# Altium schematic sheet RainbowClock.SchDoc: Rainbow Clock Project
size A4; DrawnBy: vchesnea; Organization: In alphabetical order:; Address2: - schiad; Address3: - vchesnea; Revision: A
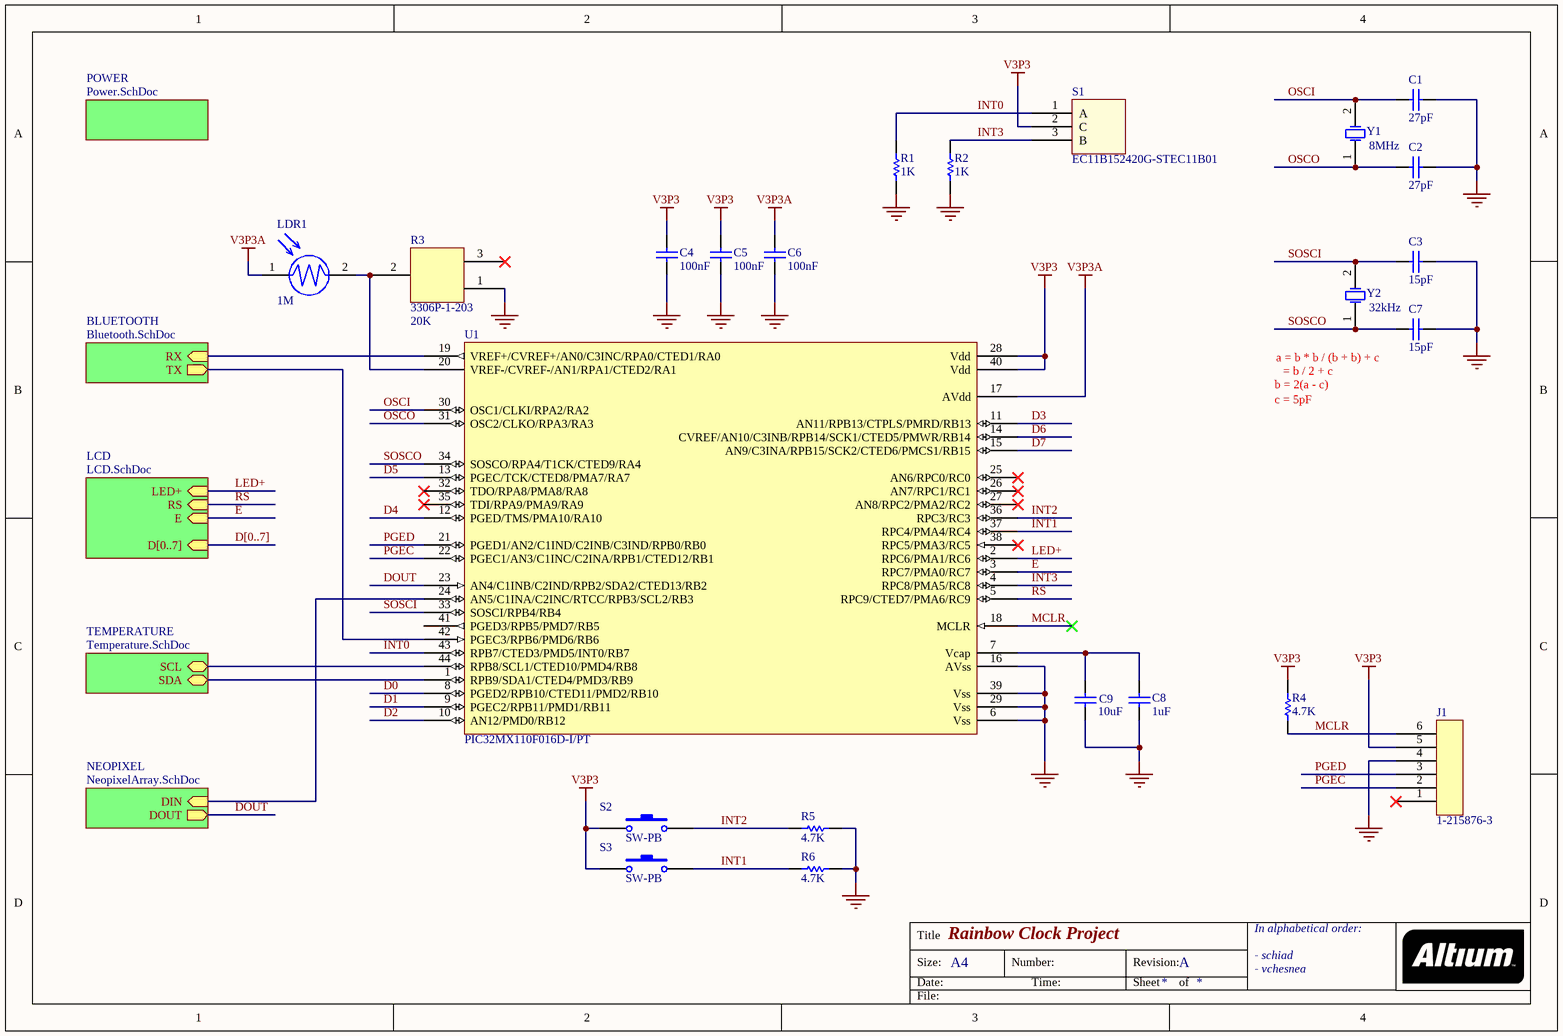
[diagram p0: RainbowClock.SchDoc]

## Parts
C1  27pF  [CAP0603]
C2  27pF  [CAP0603]
C3  15pF  [CAP0603]
C4  100nF  [CAP0603]
C5  100nF  [CAP0603]
C6  100nF  [CAP0603]
C7  15pF  [CAP0603]
C8  1uF  [CAP0603]
C9  10uF  [CAP0603]
J1  1-215876-3  [1-215876-3]
LDR1  value 1M  [VT935G]  (hidden comment: LDR)
R1  1K  [RES0603]
R2  1K  [RES0603]
R3  3306P-1-203  value 20K  [3306P-1-202]
R4  4.7K  [RES0603]
R5  4.7K  [RES0603]
R6  4.7K  [RES0603]
S1  EC11B152420G-STEC11B01  [EC11B152420G-STEC11B01]
S2  SW-PB  [1-1825027-4]
S3  SW-PB  [1-1825027-4]
U1  PIC32MX110F016D-I/PT  [PIC32MX110F016H-I/PT]
Y1  value 8MHz  [FOXSLF/080-20]  (hidden comment: 8MHz XTAL)
Y2  value 32kHz  [NCL38LF]  (hidden comment: 32kHz XTAL)

## Sub-sheets
BLUETOOTH = Bluetooth.SchDoc: RX (in), TX (out)
LCD = LCD.SchDoc: RS (in), E (in), LED+ (in), D[0..7] (in)
NEOPIXEL = NeopixelArray.SchDoc: DIN (in), DOUT (out)
POWER = Power.SchDoc: no entries
TEMPERATURE = Temperature.SchDoc: SDA (bidir), SCL (bidir)

## Nets
GND: C1.2 C2.2 C3.2 C4.1 C5.1 C6.1 C7.2 C8.1 C9.1 J1.4 R1.2 R2.1 R3.1 R5.1 R6.1 U1.6(Vss) U1.16(AVss) U1.29(Vss) U1.39(Vss)
V3P3: C4.2 C5.2 J1.5 R4.2 S1.2(C) S2.1 S3.2 U1.28(Vdd) U1.40(Vdd)
V3P3A: C6.2 LDR1.1 U1.17(AVdd)
D0: U1.8(PGED2/RPB10/CTED11/PMD2/RB10)
D1: U1.9(PGEC2/RPB11/PMD1/RB11)
D2: U1.10(AN12/PMD0/RB12)
D3: U1.11(AN11/RPB13/CTPLS/PMRD/RB13)
D4: U1.12(PGED/TMS/PMA10/RA10)
D5: U1.13(PGEC/TCK/CTED8/PMA7/RA7)
D6: U1.14(CVREF/AN10/C3INB/RPB14/SCK1/CTED5/PMWR/RB14)
D7: U1.15(AN9/C3INA/RPB15/SCK2/CTED6/PMCS1/RB15)
DOUT: U1.23(AN4/C1INB/C2IND/RPB2/SDA2/CTED13/RB2) ; sheet NEOPIXEL/DOUT
E: U1.3(RPC7/PMA0/RC7) ; sheet LCD/E
INT0: R1.1 S1.1(A) U1.43(RPB7/CTED3/PMD5/INT0/RB7)
INT1: R6.2 S3.1 U1.37(RPC4/PMA4/RC4)
INT2: R5.2 S2.2 U1.36(RPC3/RC3)
INT3: R2.2 S1.3(B) U1.4(RPC8/PMA5/RC8)
LED+: U1.2(RPC6/PMA1/RC6) ; sheet LCD/LED+
MCLR: J1.6 R4.1 U1.18(MCLR)
OSCI: C1.1 U1.30(OSC1/CLKI/RPA2/RA2) Y1.2(OSC2)
OSCO: C2.1 U1.31(OSC2/CLKO/RPA3/RA3) Y1.1(OSC1)
PGEC: J1.2 U1.22(PGEC1/AN3/C1INC/C2INA/RPB1/CTED12/RB1)
PGED: J1.3 U1.21(PGED1/AN2/C1IND/C2INB/C3IND/RPB0/RB0)
RS: U1.5(RPC9/CTED7/PMA6/RC9) ; sheet LCD/RS
SOSCI: C3.1 U1.33(SOSCI/RPB4/RB4) Y2.2(OSC2)
SOSCO: C7.1 U1.34(SOSCO/RPA4/T1CK/CTED9/RA4) Y2.1(OSC1)
NetC8_2: C8.2 C9.2 U1.7(Vcap)
NetLDR1_2: LDR1.2 R3.2 U1.20(VREF-/CVREF-/AN1/RPA1/CTED2/RA1)
NetU1_1: U1.1(RPB9/SDA1/CTED4/PMD3/RB9) ; sheet TEMPERATURE/SDA
NetU1_19: U1.19(VREF+/CVREF+/AN0/C3INC/RPA0/CTED1/RA0) ; sheet BLUETOOTH/RX
NetU1_24: U1.24(AN5/C1INA/C2INC/RTCC/RPB3/SCL2/RB3) ; sheet NEOPIXEL/DIN
NetU1_42: U1.42(PGEC3/RPB6/PMD6/RB6) ; sheet BLUETOOTH/TX
NetU1_44: U1.44(RPB8/SCL1/CTED10/PMD4/RB8) ; sheet TEMPERATURE/SCL

Not connected (* = marked no-connect by the designer): J1 1*; R3 3*; U1 25(AN6/RPC0/RC0)* 26(AN7/RPC1/RC1)* 27(AN8/RPC2/PMA2/RC2)* 32(TDO/RPA8/PMA8/RA8)* 35(TDI/RPA9/PMA9/RA9)* 38(RPC5/PMA3/RC5)* 41(PGED3/RPB5/PMD7/RB5)

## Buses and harness runs
bus D[0..7] = sheet LCD/D[0..7]

## Notes on the sheet
- (near C7) a = b * b / (b + b) + c
- = b / 2 + c
- b = 2(a - c)
- c = 5pF
- Title
- Size:
- Date:
- A4
- Number:
- Time:
- Revision:
- Sheet
- of
- File:

## Library data of the parts
C1-C9 = Cap: Capacitor
  C1 C2: Value: 27pF
  C3 C7: Value: 15pF
  C4-C6: Value: 100nF
  C8: Value: 1uF
  C9: Value: 10uF
J1 = 1-215876-3: Tyco 1-215876-3; RefFournisseur: 1773039; Fabricant: TE Connectivity; Fournisseur: Farnell; RefFabricant: 1-215876-3
LDR1 = LDR: Photoresistor; RefFournisseur: 1652638; Fabricant: Excelitas Tech; Fournisseur: Farnell; RefFabricant: VT935G
R1 R2 R4-R6 = Res1: Resistor
  R1 R2: Value: 1K
  R4-R6: Value: 4.7K
R3 = 3306P-1-202: Trimpot; RefFournisseur: 108240; Fabricant: Bourns; Fournisseur: Farnell; RefFabricant: 3306P-1-203
S1 = EC11B152420G-STEC11B01: Rotary encoder; RefFournisseur: 1191733; Fournisseur: Farnell; Fabricant: ALPS; RefFabricant: EC11B152420G-STEC11B01
S2 S3 = SW-PB: Switch; RefFournisseur: 2468742; Fournisseur: Farnell; Fabricant: TE Connectivity; RefFabricant: 1-1825027-4
U1 = PIC32MX110F016D-I/PT: Microcontroller; RefFournisseur: 2057068; Fabricant: Microchip; Fournisseur: Farnell; RefFabricant: PIC32MX110F016D-I/PT
Y1 = XTAL: Crystal Oscillator; Fournisseur: Farnell; Fabricant: Fox Electronics; RefFournisseur: 2057960; RefFabricant: FOXSLF/080-20
Y2 = XTAL: Crystal Oscillator; Fabricant: Fox Electronics; Fournisseur: Farnell; RefFabricant: NC38LF-327; RefFournisseur: 2064058